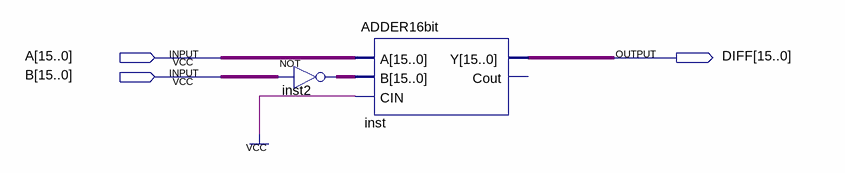
[diagram p0: schematic sheet]
// Quartus schematic SUB16bit.bdf as structural Verilog: 2 symbols, 3 pins
module SUB16bit (
  input  [15:0] A,
  input  [15:0] B,
  output [15:0] DIFF
);

  wire [15:0] inst2_out;

  assign inst2_out = ~B;  // NOT inst2, 16 bits wide
  ADDER16bit inst (.A(A), .B(inst2_out), .CIN(1'b1), .Y(DIFF));  // open: Cout
endmodule
